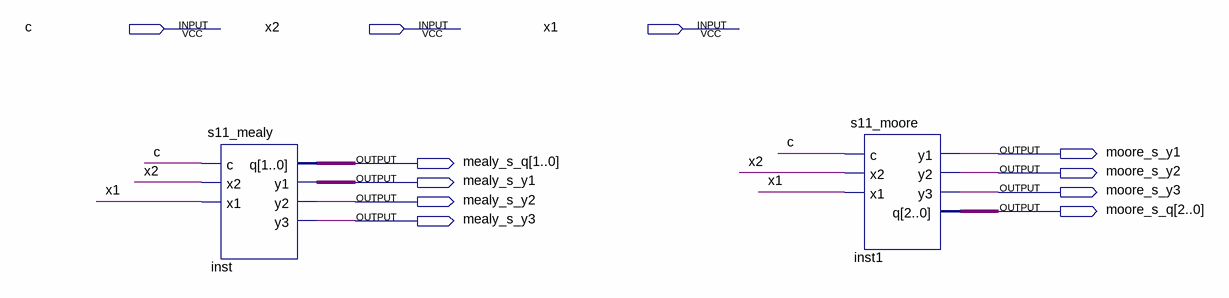
[diagram p0: schematic sheet]
// Quartus schematic s11.bdf as structural Verilog: 2 symbols, 11 pins
module s11 (
  input  c,
  input  x2,
  input  x1,
  output moore_s_y1,
  output [1:0] mealy_s_q,
  output moore_s_y2,
  output mealy_s_y1,
  output moore_s_y3,
  output mealy_s_y2,
  output [2:0] moore_s_q,
  output mealy_s_y3
);

  s11_mealy inst (.c(c), .x2(x2), .x1(x1), .q(mealy_s_q), .y1(mealy_s_y1), .y2(mealy_s_y2), .y3(mealy_s_y3));
  s11_moore inst1 (.c(c), .x2(x2), .x1(x1), .y1(moore_s_y1), .y2(moore_s_y2), .y3(moore_s_y3), .q(moore_s_q));
endmodule
